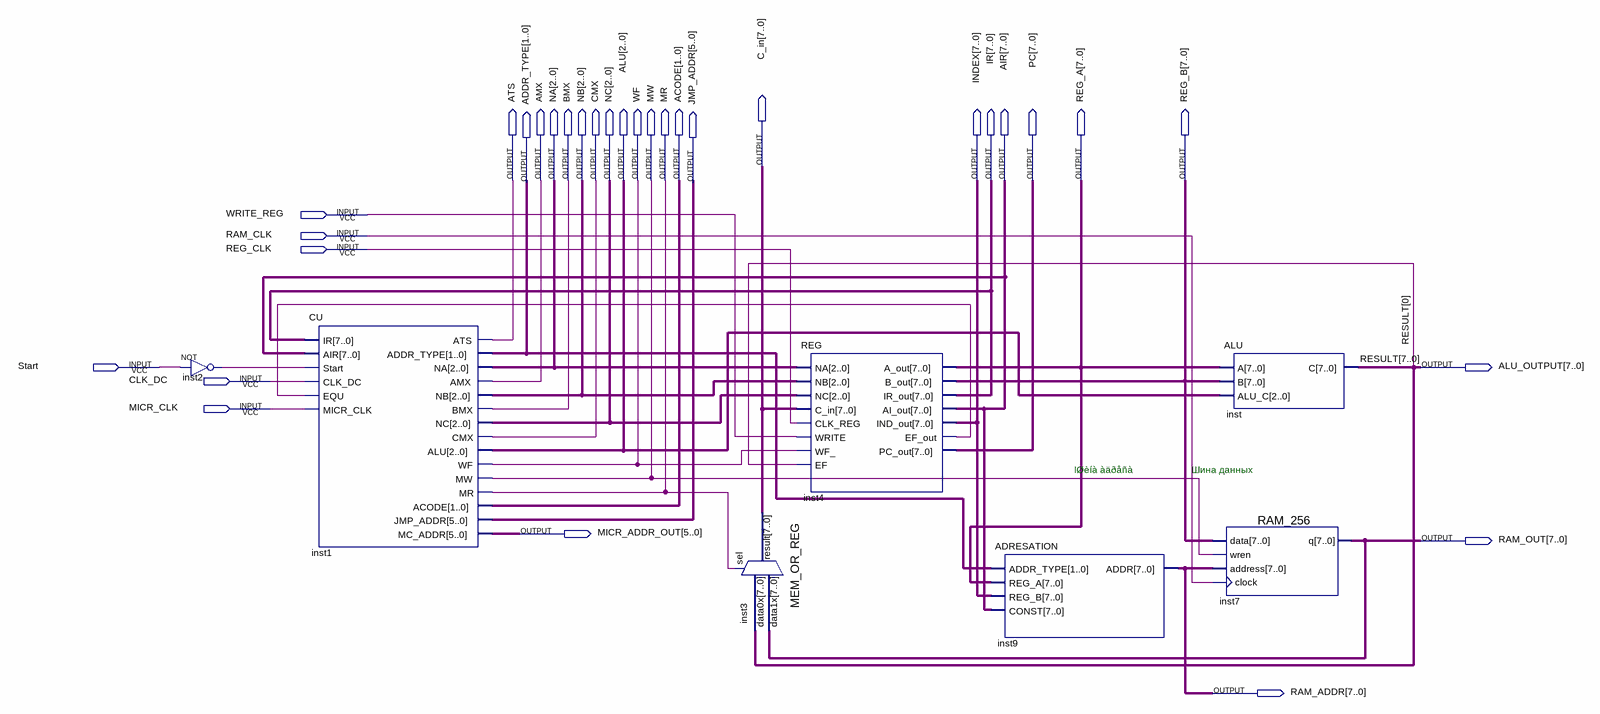
[diagram p0: schematic sheet]
// Quartus schematic CPU.bdf as structural Verilog: 7 symbols, 31 pins
module CPU (
  input  WRITE_REG,
  input  RAM_CLK,
  input  REG_CLK,
  input  Start,
  input  CLK_DC,
  input  MICR_CLK,
  output [7:0] C_in,
  output ATS,
  output [1:0] ADDR_TYPE,
  output AMX,
  output [2:0] NA,
  output BMX,
  output [2:0] NB,
  output CMX,
  output [2:0] NC,
  output [2:0] ALU,
  output WF,
  output MW,
  output MR,
  output [1:0] ACODE,
  output [5:0] JMP_ADDR,
  output [7:0] INDEX,
  output [7:0] IR,
  output [7:0] AIR,
  output [7:0] PC,
  output [7:0] REG_A,
  output [7:0] REG_B,
  output [7:0] ALU_OUTPUT,
  output [5:0] MICR_ADDR_OUT,
  output [7:0] RAM_OUT,
  output [7:0] RAM_ADDR
);

  wire inst2_out, inst4_ef_out;

  not inst2 (inst2_out, Start);
  CU inst1 (
    .IR(IR), .AIR(AIR), .Start(inst2_out), .CLK_DC(CLK_DC), .EQU(inst4_ef_out), .MICR_CLK(MICR_CLK),
    .ATS(ATS), .ADDR_TYPE(ADDR_TYPE), .NA(NA), .AMX(AMX), .NB(NB), .BMX(BMX), .NC(NC), .CMX(CMX), .ALU(ALU),
    .WF(WF), .MW(MW), .MR(MR), .ACODE(ACODE), .JMP_ADDR(JMP_ADDR), .MC_ADDR(MICR_ADDR_OUT));
  MEM_OR_REG inst3 (.data1x(RAM_OUT), .data0x(ALU_OUTPUT), .sel(MR), .result(C_in));
  REG inst4 (
    .NA(NA), .NB(NB), .NC(NC), .C_in(C_in), .CLK_REG(REG_CLK), .WRITE(WRITE_REG), .WF_(WF),
    .EF(ALU_OUTPUT[0]), .A_out(REG_A), .B_out(REG_B), .IR_out(IR), .AI_out(AIR), .IND_out(INDEX),
    .EF_out(inst4_ef_out), .PC_out(PC));
  ADRESATION inst9 (.ADDR_TYPE(ADDR_TYPE), .REG_A(REG_A), .REG_B(INDEX), .CONST(AIR), .ADDR(RAM_ADDR));
  RAM_256 inst7 (.data(REG_B), .wren(MW), .address(RAM_ADDR), .clock(RAM_CLK), .q(RAM_OUT));
  ALU inst (.A(REG_A), .B(REG_B), .ALU_C(ALU), .C(ALU_OUTPUT));

  // Other names for the same wires on the sheet: RESULT[7:0] = ALU_OUTPUT

  // Notes on the sheet:
  //   IØèíà àäðåñà
  //   Шина данных
endmodule
